# EAGLE design AMP (EAGLE 9.6.2)
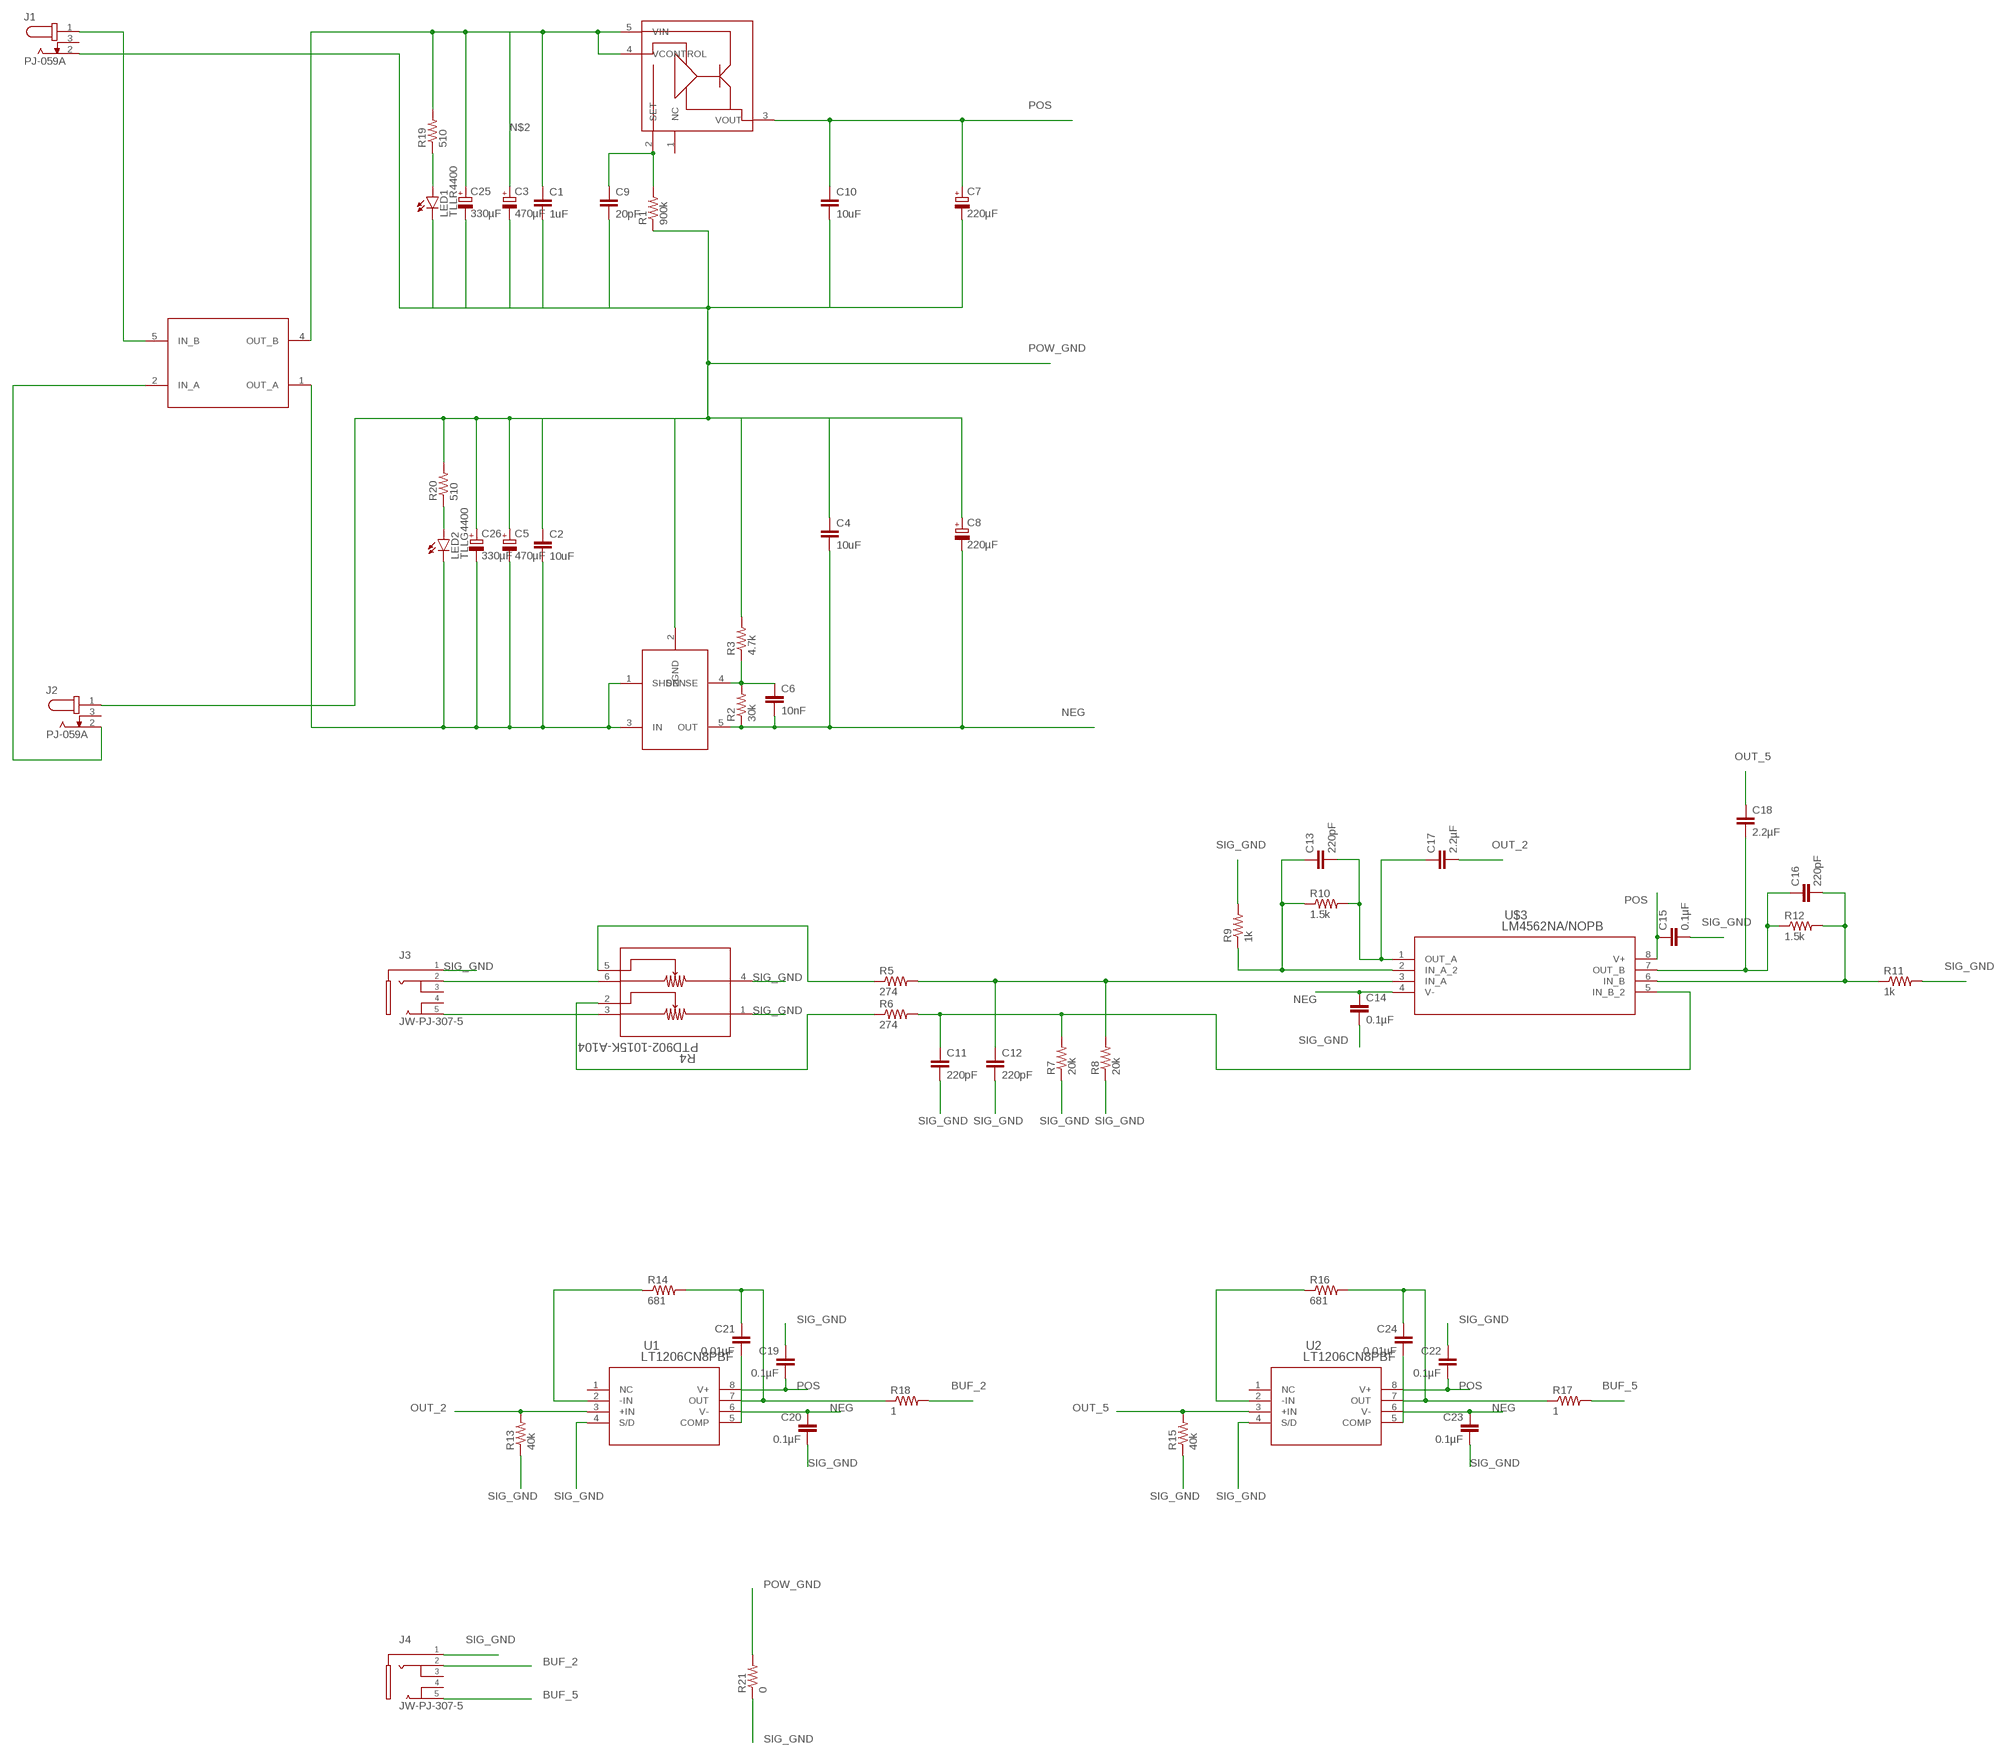
[diagram p0: schematic, sheet 1]

## Parts
C1  1uF  C-EU050-025X075  [C050-025X075]
C2  10uF  C-EU050-025X075  [C050-025X075]
C3  470µF  CPOL-EUE3.5-8  [E3,5-8]
C4  10uF  C-EU050-025X075  [C050-025X075]
C5  470µF  CPOL-EUE3.5-8  [E3,5-8]
C6  10nF  C-EU025-025X050  [C025-025X050]
C7  220µF  CPOL-EUE3.5-8  [E3,5-8]
C8  220µF  CPOL-EUE3.5-8  [E3,5-8]
C9  20pF  C-EU025-025X050  [C025-025X050]
C10  10uF  C-EU050-025X075  [C050-025X075]
C11  220pF  C-EU050-025X075  [C050-025X075]
C12  220pF  C-EU050-025X075  [C050-025X075]
C13  220pF  C-EU050-025X075  [C050-025X075]
C14  0.1µF  C-EU050-025X075  [C050-025X075]
C15  0.1µF  C-EU050-025X075  [C050-025X075]
C16  220pF  C-EU050-025X075  [C050-025X075]
C17  2.2µF  C-EU050-025X075  [C050-025X075]
C18  2.2µF  C-EU050-025X075  [C050-025X075]
C19  0.1µF  C-EU050-025X075  [C050-025X075]
C20  0.1µF  C-EU050-025X075  [C050-025X075]
C21  0.01µF  C-EU050-025X075  [C050-025X075]
C22  0.1µF  C-EU050-025X075  [C050-025X075]
C23  0.1µF  C-EU050-025X075  [C050-025X075]
C24  0.01µF  C-EU050-025X075  [C050-025X075]
C25  330µF  CPOL-EUE3.5-8  [E3,5-8]
C26  330µF  CPOL-EUE3.5-8  [E3,5-8]
J1  PJ-059A  [CUI_PJ-059A]
J2  PJ-059A  [CUI_PJ-059A]
J3  JW-PJ-307-5  [JW-PJ-307-X]
J4  JW-PJ-307-5  [JW-PJ-307-X]
LED1  TLLR4400  [LED3MM]
LED2  TLLG4400  [LED3MM]
R1  900k  R-US_0207/10  [0207/10]
R2  30k  R-US_0207/10  [0207/10]
R3  4.7k  R-US_0207/10  [0207/10]
R4  PTD902-1015K-A104  [PTD902-15K_BRN]
R5  274  R-US_0207/10  [0207/10]
R6  274  R-US_0207/10  [0207/10]
R7  20k  R-US_0207/10  [0207/10]
R8  20k  R-US_0207/10  [0207/10]
R9  1k  R-US_0207/10  [0207/10]
R10  1.5k  R-US_0207/10  [0207/10]
R11  1k  R-US_0207/10  [0207/10]
R12  1.5k  R-US_0207/10  [0207/10]
R13  40k  R-US_0207/10  [0207/10]
R14  681  R-US_0207/10  [0207/10]
R15  40k  R-US_0207/10  [0207/10]
R16  681  R-US_0207/10  [0207/10]
R17  1  R-US_0207/10  [0207/10]
R18  1  R-US_0207/10  [0207/10]
R19  510  R-US_0207/10  [0207/10]
R20  510  R-US_0207/10  [0207/10]
R21  0  R-US_0207/10  [0207/10]
SWITCH1  M2022  [M2022]
U1  LT1206CN8PBF  [PDIP-8_N_LIT]
U2  LT1206CN8PBF  [PDIP-8_N_LIT]
U$1  LT3080  [TO220-5]
U$2  LT3015LT3015  [TO220-5]
U$3  LM4562NA/NOPB  [N08E]

## Nets
BUF_2: J4.P$2 R18.2
BUF_5: J4.P$4 R17.2
N$1: R4.5 R5.1
N$2: C1.1 C3.+ C25.+ R19.2 SWITCH1.4(OUT_B) U$1.4(VCONTROL) U$1.5(VIN)
N$3: C9.1 R1.2 U$1.2(SET)
N$4: R4.2 R6.1
N$5: C2.2 C5.- C26.- LED2.K(C) SWITCH1.1(OUT_A) U$2.1(SHDN) U$2.3(IN)
N$6: J3.P$2 R4.6
N$7: C6.1 R2.2 R3.1 U$2.4(SENSE)
N$8: J3.P$4 R4.3
N$9: C12.1 R5.2 R8.2 U$3.3(IN_A)
N$10: C11.1 R6.2 R7.2 U$3.5(IN_B_2)
N$11: C16.2 R11.1 R12.2 U$3.6(IN_B)
N$12: C13.2 C17.1 R10.2 U$3.1(OUT_A)
N$13: C21.1 R14.2 R18.1 U1.7(OUT)
N$14: C13.1 R9.1 R10.1 U$3.2(IN_A_2)
N$15: C16.1 C18.2 R12.1 U$3.7(OUT_B)
N$16: R14.1 U1.2(-IN)
N$17: C21.2 U1.5(COMP)
N$18: C24.1 R16.2 R17.1 U2.7(OUT)
N$19: R16.1 U2.2(-IN)
N$20: C24.2 U2.5(COMP)
N$21: J2.2 SWITCH1.2(IN_A)
N$22: J1.1 SWITCH1.5(IN_B)
N$23: LED1.A R19.1
N$24: LED2.A R20.1
NEG: C4.2 C6.2 C8.- C14.1 C20.1 C23.1 R2.1 U1.6(V-) U2.6(V-) U$2.5(OUT) U$3.4(V-)
OUT_2: C17.2 R13.2 U1.3(+IN)
OUT_5: C18.1 R15.2 U2.3(+IN)
POS: C7.+ C10.1 C15.1 C19.2 C22.2 U1.8(V+) U2.8(V+) U$1.3(VOUT) U$3.8(V+)
POW_GND: C1.2 C2.1 C3.- C4.1 C5.+ C7.- C8.+ C9.2 C10.2 C25.- C26.+ J1.2 J2.1 LED1.K(C) R1.1 R3.2 R20.2 R21.2 U$2.2(GND)
SIG_GND: C11.2 C12.2 C14.2 C15.2 C19.1 C20.2 C22.1 C23.2 J3.P$5 J4.P$5 R4.1 R4.4 R7.1 R8.1 R9.2 R11.2 R13.1 R15.1 R21.1 U1.4(S/D) U2.4(S/D)
Unconnected: J1.3 J2.3 J3.P$1 J3.P$3 J4.P$1 J4.P$3 U1.1(NC) U2.1(NC) U$1.1(NC)

## Library data of the parts
C1 C2 C4 C6 C9-C24 = rcl:C-EU: CAPACITOR, European symbol; SPICEPREFIX: C
C3 C5 C7 C8 C25 C26 = rcl:CPOL-EU: POLARIZED CAPACITOR, European symbol; SPICEPREFIX: C
J1 J2 = PJ-059A:PJ-059A: 2.0 mm Center Pin, 2.5 A, Right Angle, Through Hole, Tapered Pins, Locking Type, Dc Power Jack Connector Check prices <https://pricing.snapeda.com/parts/PJ-059A/CUI%20Devices/view-part?ref=eda>; AVAILABILITY: Good; CUI_PURCHASE_URL: https://www.cuidevices.com/product/interconnect/connectors/dc-power-connectors/jacks/pj-059a?utm_source=snapeda.com&utm_medium=referral&utm_campaign=snapedaBOM; DESCRIPTION: 2.0 x 5.7 mm, 2.5 A, Horizontal, Through Hole, Tapered Pins, Locking Type, Dc Power Jack Connector; MF: CUI Devices; MP: PJ-059A; PACKAGE: None; PRICE: None; PURCHASE-URL: https://pricing.snapeda.com/search/part/PJ-059A/?ref=eda
J3 J4 = auxil:JW-PJ-307-5
LED1 = led:TLLR4400: Low Current (2mA) LED 3 mm Tinted Diffused Package color RED Source: Data sheet <http://www.farnell.com/datasheets/391100.pdf>; MF: VISHAY SEMICONDUCTOR; OC_FARNELL: 1612437
LED2 = led:TLLG4400: Low Current (2mA) LED 3 mm Tinted Diffused Package color GREEN Source: Data sheet <http://www.farnell.com/datasheets/391098.pdf>; MF: VISHAY SEMICONDUCTOR; OC_FARNELL: 1612435
R1-R3 R5-R21 = rcl:R-US_: RESISTOR, American symbol; SPICEPREFIX: R
R4 = PTD902:PTD902-1015K-A104; BUILT_BY: EMA_Cory; COPYRIGHT: Copyright (C) 2018 Accelerated Designs. All rights reserved; DATASHEET: https://www.bourns.com/docs/Product-Datasheets/PTD90.pdf; MANUFACTURER_PART_NUMBER: PTD902-1015K-A104; SOURCELIBRARY: Bourns_Electronics_2020-05-06; VENDOR: Bourns Electronics
SWITCH1 = M2022:M2022
U1 U2 = LT1206:LT1206CN8PBF; BUILT_BY: EMA_UL_Team; MANUFACTURER_PART_NUMBER: LT1206CN8#PBF; SOURCELIBRARY: LinearTech_2016-05-13_9; VENDOR: Linear Technology
U$1 = GD_LT3080:LT3080
U$2 = REAL_LT3015:LT3015
U$3 = LM4562:LM4562NA/NOPB; MANUFACTURER_PART_NUMBER: LM4562NA/NOPB; VENDOR: National

## Net classes
0 default: width 0.305 mm, drill 0.508 mm, clearance 0.254 mm

## Board
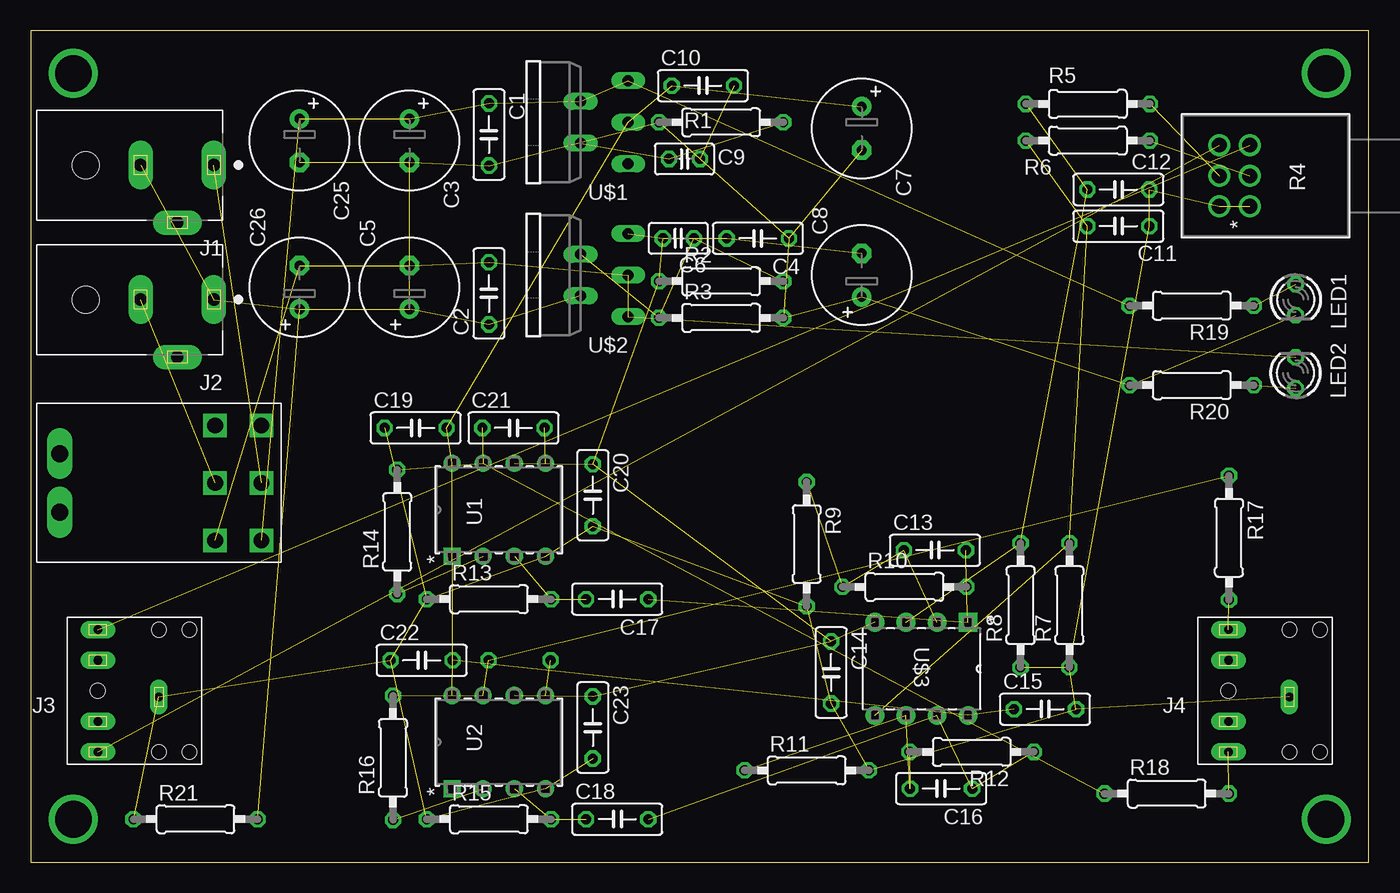
[diagram p1: board, top side]
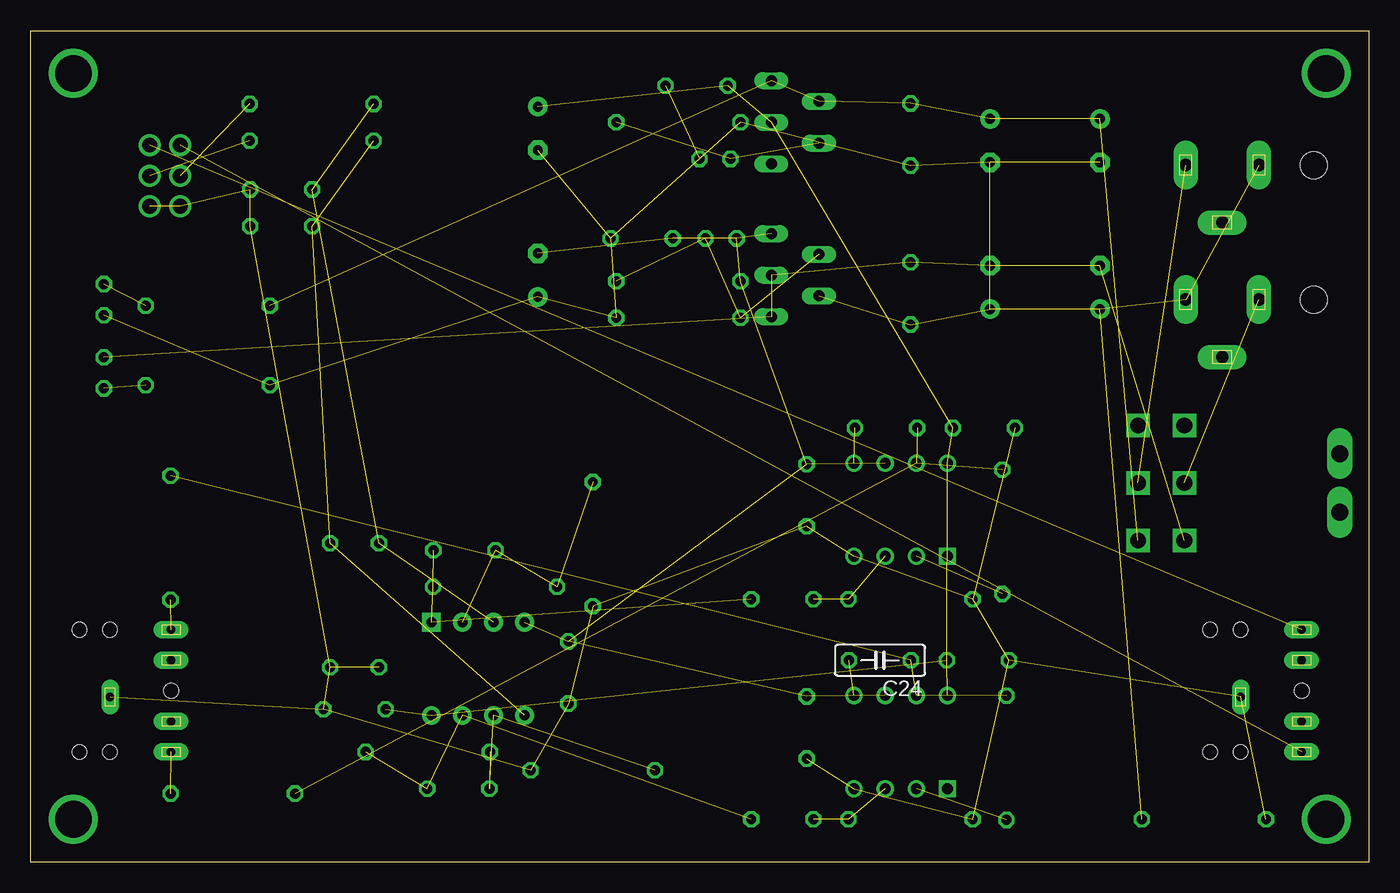
[diagram p2: board, bottom side, seen from below]

Size 109.5 x 68 mm. Coordinates in mm from the lower left corner, seen from the top.
Outline: 0,0 109.5,0 109.5,68 0,68 0,0
Copper layers (1*16): Top 0.035mm / dielectric 1.5mm / Bottom 0.035mm
Design rules "default": minimum track width 6mil, minimum drill 0.35mm, track to track 6mil, track to pad 6mil, pad to pad 6mil, via to via 6mil, smd to smd 6mil, copper to edge 40mil, drill to drill 6mil, minimum pad ring 10mil, minimum via ring 8mil, stop-mask expansion 4mil, vias tented up to drill 0mil, thermal gap 10mil

### Footprints (pad centres in the part's own frame; a part is rotated, then mirrored left to right if it is on the bottom)
C050-025X075 = drill 0.813 octagon: 1 -2.54,0; 2 2.54,0
E3,5-8 = drill 0.813 pad 1.6: + -1.778,0 | drill 0.813 pad 1.6 octagon: - 1.778,0
C025-025X050 = drill 0.813 octagon: 1 -1.27,0; 2 1.27,0
CUI_PJ-059A = drill 1 pad 2 long: 1 0,0; 2 6,0; 3 3,4.7 | hole 2.2: 10.5,0
JW-PJ-307-X = drill 0.7 pad 1.422 long: P$1 3,2.5; P$2 3,5; P$3 3,-2.5; P$4 3,-5; P$5 -2,0.5 | hole 1.2: -4.5,5; -2,5; 3,0; -4.5,-5; -2,-5
LED3MM = drill 0.813 octagon: A -1.27,0; K 1.27,0
0207/10 = drill 0.813 octagon: 1 -5.08,0; 2 5.08,0
PTD902-15K_BRN = drill 1.194 pad 1.702: 1 0,0; 2 2.489,0; 3 5.004,0; 4 0,2.489; 5 2.489,2.489; 6 5.004,2.489
M2022 = drill 1.28 square: 1 14.6,1.8; 2 14.6,6.5; 3 14.6,11.2; 4 18.4,1.8; 5 18.4,6.5; 6 18.4,11.2 | drill 1.4 long: SUPP_1 1.9,8.9; SUPP_2 1.9,4.1
PDIP-8_N_LIT = drill 0.889 pad 1.397 square: 1 0,0 | drill 0.889 pad 1.397: 2 0,-2.54; 3 0,-5.08; 4 0,-7.62; 5 7.62,-7.62; 6 7.62,-5.08; 7 7.62,-2.54; 8 7.62,0
TO220-5 = drill 0.9 long: 1 -3.4,-8.4; 2 -1.7,-4.5; 3 0,-8.4; 4 1.7,-4.5; 5 3.4,-8.4
N08E = drill 0.813 pad 1.524 square: 1 -7.62,7.62 | drill 0.813 pad 1.524: 2 -7.62,5.08; 3 -7.62,2.54; 4 -7.62,0; 5 0,0; 6 0,2.54; 7 0,5.08; 8 0,7.62

### Placement (x,y rotation side)
C1  37.5,59.5 270 top
C2  37.5,46.5 90 top
C3  31,59 270 top
C4  59.5,51 180 top
C5  31,47 90 top
C6  53,51 180 top
C7  68,60 270 top
C8  68,48 90 top
C9  53.5,57.5 0 top
C10  55,63.5 0 top
C11  89,52 0 top
C12  89,55 0 top
C13  74,25.5 0 top
C14  65.5,15.5 270 top
C15  83,12.5 0 top
C16  74.5,6 180 top
C17  48,21.5 180 top
C18  48,3.5 0 top
C19  31.5,35.5 0 top
C20  46,30 270 top
C21  39.5,35.5 0 top
C22  32,16.5 0 top
C23  46,11 270 top
C24  40,16.5 180 bottom
C25  22,59 270 top
C26  22,47 90 top
J1  15,57 180 top
J2  15,46 180 top
J3  8.5,14 180 top
J4  101,14 180 top
LED1  103.5,46 270 top
LED2  103.5,40 90 top
R1  56.5,60.5 0 top
R2  56.5,47.5 0 top
R3  56.5,44.5 0 top
R4  99.75,53.63 90 top
R5  86.5,62 180 top
R6  86.5,59 180 top
R7  85,21 90 top
R8  81,21 90 top
R9  63.5,26 270 top
R10  71.5,22.5 0 top
R11  63.5,7.5 0 top
R12  77,9 180 top
R13  37.5,21.5 0 top
R14  30,27 90 top
R15  37.5,3.5 0 top
R16  29.65,8.52 90 top
R17  98.05,26.52 270 top
R18  92.95,5.6 0 top
R19  95,45.5 180 top
R20  95,39 180 top
R21  13.5,3.5 0 top
SWITCH1  0.5,24.5 0 top
U1  34.5,25 90 top
U2  34.5,6 90 top
U$1  40.5,60.5 90 top
U$2  40.5,48 90 top
U$3  69.08,11.99 270 top

### Tracks (layer width: path | path; a pad name or v marks a point on that pad's centre or on a via)
BUF_2  (1 unrouted)
BUF_5  (1 unrouted)
N$1  (1 unrouted)
N$2  (6 unrouted)
N$3  (2 unrouted)
N$4  (1 unrouted)
N$5  (6 unrouted)
N$6  (1 unrouted)
N$7  (3 unrouted)
N$8  (1 unrouted)
N$9  (3 unrouted)
N$10  (3 unrouted)
N$11  (3 unrouted)
N$12  (3 unrouted)
N$13  (3 unrouted)
N$14  (3 unrouted)
N$15  (3 unrouted)
N$16  (1 unrouted)
N$17  (1 unrouted)
N$18  (3 unrouted)
N$19  (1 unrouted)
N$20  (1 unrouted)
N$21  (1 unrouted)
N$22  (1 unrouted)
N$23  (1 unrouted)
N$24  (1 unrouted)
N$25  (via drill 3)
  other vias: 3.5,64.5
N$26  (via drill 3)
  other vias: 3.5,3.5
N$27  (via drill 3)
  other vias: 106,3.5
N$28  (via drill 3)
  other vias: 106,64.5
NEG  (10 unrouted)
OUT_2  (2 unrouted)
OUT_5  (2 unrouted)
POS  (8 unrouted)
POW_GND  (18 unrouted)
SIG_GND  (20 unrouted)